# EAGLE schematic ece4416-project-v2 (EAGLE 6.2)
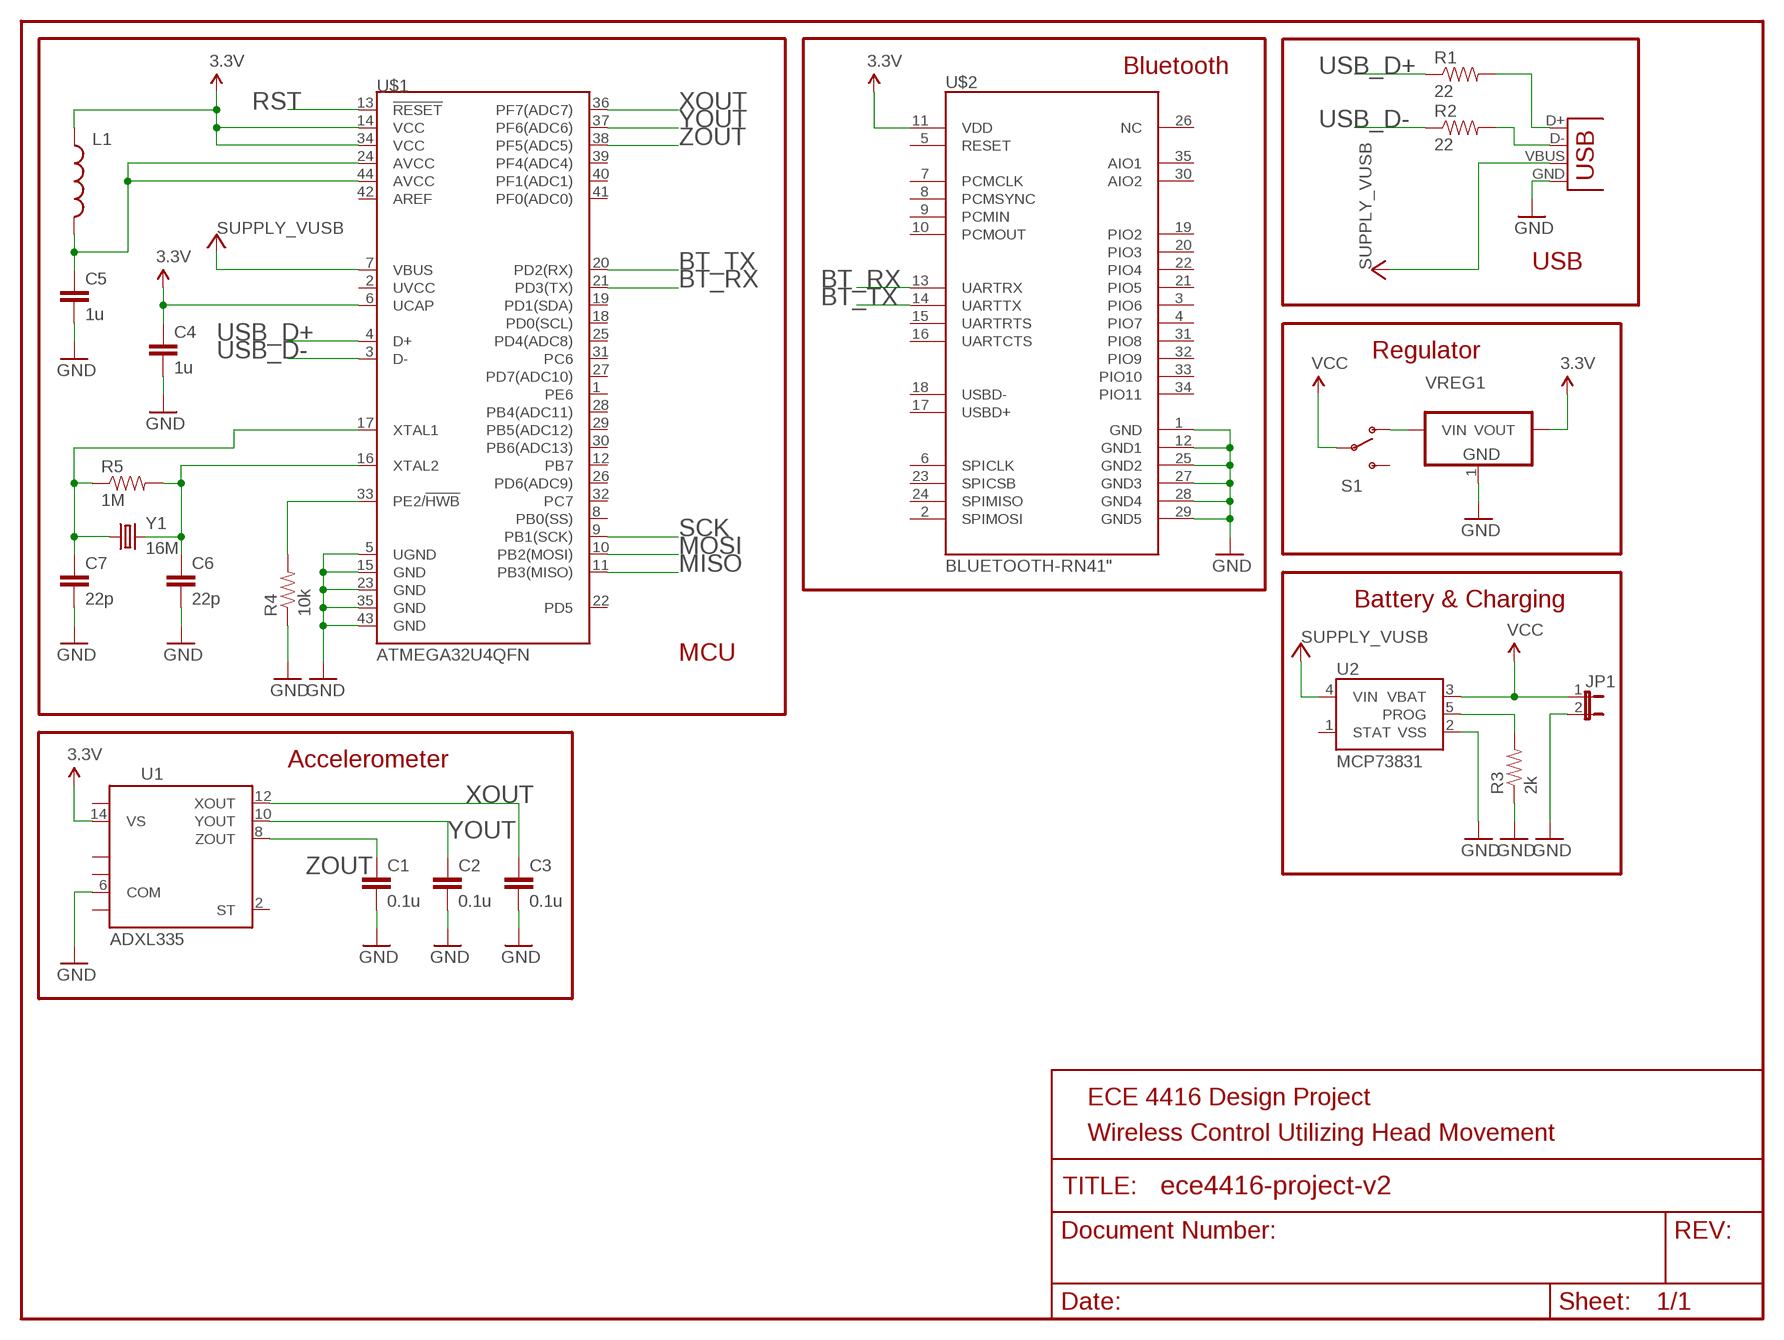
[diagram p0: schematic, sheet 1]

## Parts
C1  0.1u  CAP0603-CAP  [0603-CAP]
C2  0.1u  CAP0603-CAP  [0603-CAP]
C3  0.1u  CAP0603-CAP  [0603-CAP]
C4  1u  CAP0603-CAP  [0603-CAP]
C5  1u  CAP0603-CAP  [0603-CAP]
C6  22p  CAP0603-CAP  [0603-CAP]
C7  22p  CAP0603-CAP  [0603-CAP]
JP1  JUMPER-2PTH  [1X02]
L1  INDUCTOR0805  [0805]
R1  22  RESISTOR0603-RES  [0603-RES]
R2  22  RESISTOR0603-RES  [0603-RES]
R3  2k  RESISTOR0603-RES  [0603-RES]
R4  10k  RESISTOR0603-RES  [0603-RES]
R5  1M  RESISTOR0603-RES  [0603-RES]
S1  SWITCH-SPST-SMD-A  [SWITCH-SPST-SMD-A]
U1  ADXL335  [LFCSP-16]
U2  MCP73831  [SOT23-5]
U$1  ATMEGA32U4QFN  [QFN-44]
U$2  BLUETOOTH-RN41"  [RN41]
VREG1  VREG_3PINS-SOT-223  [SOT-223]
X1  USB-MICROB  [USB-MICROB]
Y1  16M  CRYSTAL5X3  [CRYSTAL-SMD-5X3]

## Nets
3.3V: C4.1 L1.1 U1.14(VS) U$1.6(UCAP) U$1.14(VCC) U$1.34(VCC) U$2.11(VDD) VREG1.2(VOUT)
BT_RX: U$1.21(PD3(TX)) U$2.13(UARTRX)
BT_TX: U$1.20(PD2(RX)) U$2.14(UARTTX)
MISO: U$1.11(PB3(MISO))
MOSI: U$1.10(PB2(MOSI))
N$1: S1.1(O) VREG1.3(VIN)
N$2: R2.2 X1.D-
N$3: R1.2 X1.D+
N$4: R4.2 U$1.33(PE2/!HWB)
N$5: R3.2 U2.5(PROG)
N$7: C5.1 L1.2 U$1.24(AVCC) U$1.44(AVCC)
N$9: C6.1 R5.2 U$1.16(XTAL2) Y1.3
N$10: C7.1 R5.1 U$1.17(XTAL1) Y1.1
N$25: C1.2 C2.2 C3.2 C4.2 C5.2 C6.2 C7.2 JP1.2 R3.1 R4.1 U1.6(COM) U2.2(VSS) U$1.5(UGND) U$1.15(GND) U$1.23(GND) U$1.35(GND) U$1.43(GND) U$2.1(GND) U$2.12(GND1) U$2.25(GND2) U$2.27(GND3) U$2.28(GND4) U$2.29(GND5) VREG1.1(GND) X1.GND ; supply symbol labelled GND
RST: U$1.13(!RESET)
SCK: U$1.9(PB1(SCK))
USB_D+: R1.1 U$1.4(D+)
USB_D-: R2.1 U$1.3(D-)
VCC: JP1.1 S1.2(P) U2.3(VBAT)
VUSB: U2.4(VIN) U$1.7(VBUS) X1.VBUS ; supply symbol labelled SUPPLY_VUSB
XOUT: C3.1 U1.12(XOUT) U$1.36(PF7(ADC7))
YOUT: C2.1 U1.10(YOUT) U$1.37(PF6(ADC6))
ZOUT: C1.1 U1.8(ZOUT) U$1.38(PF5(ADC5))
Unconnected: S1.3(S) U1.2(ST) U1.3(COM) U1.5(COM) U1.7(COM) U1.15(VS) U2.1(STAT) U$1.1(PE6) U$1.2(UVCC) U$1.8(PB0(SS)) U$1.12(PB7) U$1.18(PD0(SCL)) U$1.19(PD1(SDA)) U$1.22(PD5) U$1.25(PD4(ADC8)) U$1.26(PD6(ADC9)) U$1.27(PD7(ADC10)) U$1.28(PB4(ADC11)) U$1.29(PB5(ADC12)) U$1.30(PB6(ADC13)) U$1.31(PC6) U$1.32(PC7) U$1.39(PF4(ADC4)) U$1.40(PF1(ADC1)) U$1.41(PF0(ADC0)) U$1.42(AREF) U$2.2(SPIMOSI) U$2.3(PIO6) U$2.4(PIO7) U$2.5(RESET) U$2.6(SPICLK) U$2.7(PCMCLK) U$2.8(PCMSYNC) U$2.9(PCMIN) U$2.10(PCMOUT) U$2.15(UARTRTS) U$2.16(UARTCTS) U$2.17(USBD+) U$2.18(USBD-) U$2.19(PIO2) U$2.20(PIO3) U$2.21(PIO5) U$2.22(PIO4) U$2.23(SPICSB) U$2.24(SPIMISO) U$2.26(NC) U$2.30(AIO2) U$2.31(PIO8) U$2.32(PIO9) U$2.33(PIO10) U$2.34(PIO11) U$2.35(AIO1)

## Notes on the sheet
- Bluetooth
- USB
- Regulator
- Battery & Charging
- MCU
- Accelerometer
- ECE 4416 Design Project
- Wireless Control Utilizing Head Movement

## Library data of the parts
C1-C7 = SparkFun:CAP: Capacitor Standard 0603 ceramic capacitor, and 0.1" leaded capacitor.
JP1 = SparkFun:JUMPER-2: Jumper Basic 0.1" spaced jumper. Use with breakaway headers.
L1 = SparkFun:INDUCTOR: Inductors Basic Inductor/Choke - 0603 and 1206. Footprints are not proven and vary greatly between part numbers.
R1-R5 = SparkFun:RESISTOR: Resistor Basic schematic elements and footprints for 0603, 1206, and PTH resistors.
S1 = SparkFun:SWITCH-SPST: SPST Switch Simple slide switch. Spark Fun Electronics SKU : COM-00102
U1 = SparkFun:ADXL335
U2 = SparkFun:MCP73831: Microchip's MCP73831 Miniature single cell, fully integrated Li-Ion, Li-polymer charge management controller http://ww1.microchip.com/downloads/en/DeviceDoc/21984a.pdf
U$1 = SparkFun:ATMEGA32U4
U$2 = SparkFun:BLUETOOTH-RN41
VREG1 = dp_devices:VREG_3PINS: Various 3 pin voltage regulators in different packages Double check the right pinout for the right part
X1 = SparkFun:USB: USB Connectors USB-B-PTH is fully proven SKU : PRT-00139 USB-miniB is fully proven SKU : PRT-00587 USB-A-PCB is untested. USB-A-H is throughly reviewed, but untested. Spark Fun Electronics SKU : PRT-00437 USB-B-SMT is throughly reviewed, but untested. Needs silkscreen touching up. USB-A-S has not been used/tested USB-MB-H has not been used/tested
Y1 = SparkFun:CRYSTAL: Crystals Various standard crystals. Proven footprints. Spark Fun Electronics SKU : COM-00534